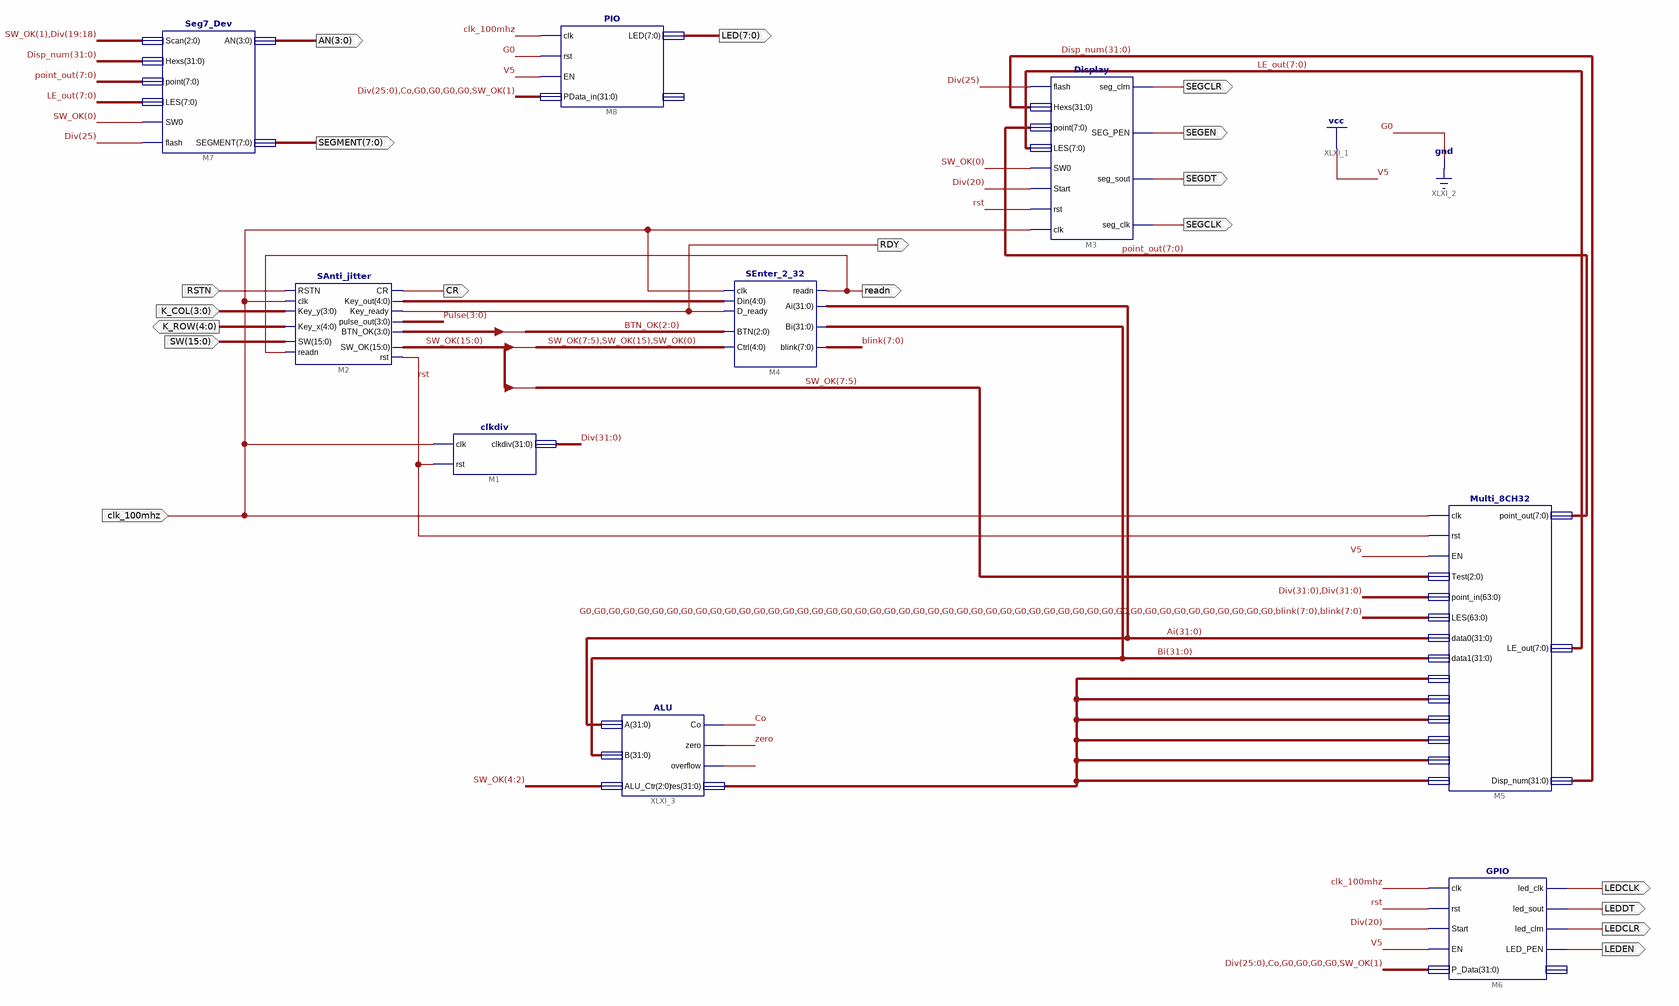
[diagram p0: schematic sheet 1]
// Xilinx ISE schematic Frame.sch (kintex7) as structural Verilog: 9 symbols, 19 ports
module Frame (
  input  RSTN,
  input  [3:0] K_COL,
  input  [15:0] SW,
  input  clk_100mhz,
  output [4:0] K_ROW,
  output readn,
  output RDY,
  output CR,
  output SEGCLR,
  output SEGEN,
  output SEGDT,
  output SEGCLK,
  output LEDCLK,
  output LEDDT,
  output LEDCLR,
  output LEDEN,
  output [7:0] LED,
  output [7:0] SEGMENT,
  output [3:0] AN
);

  wire Co, rst, XLXN_59, zero;
  wire [3:0] BTN_OK, Pulse;
  wire [4:0] XLXN_25;
  wire [7:0] blink, LE_out, point_out;
  wire [15:0] SW_OK;
  wire [31:0] Ai, Bi, Disp_num, Div, XLXN_62;

  SAnti_jitter M2 (
    .SW(SW), .readn(readn), .Key_y(K_COL), .Key_x(K_ROW), .RSTN(RSTN), .clk(clk_100mhz), .Key_out(XLXN_25),
    .Key_ready(RDY), .CR(CR), .rst(rst), .SW_OK(SW_OK), .pulse_out(Pulse), .BTN_OK(BTN_OK));
  Seg7_Dev M7 (
    .Scan({SW_OK[1], Div[19:18]}), .Hexs(Disp_num), .point(point_out), .LES(LE_out), .flash(Div[25]),
    .SW0(SW_OK[0]), .AN(AN), .SEGMENT(SEGMENT));
  PIO M8 (
    .clk(clk_100mhz), .rst(1'b0), .EN(1'b1), .PData_in({Div[25:0], Co, 4'b0000, SW_OK[1]}), .LED(LED));  // open: GPIOf0
  Display M3 (
    .flash(Div[25]), .Hexs(Disp_num), .point(point_out), .LES(LE_out), .SW0(SW_OK[0]), .Start(Div[20]),
    .rst(rst), .clk(clk_100mhz), .seg_clrn(SEGCLR), .SEG_PEN(SEGEN), .seg_sout(SEGDT), .seg_clk(SEGCLK));
  Multi_8CH32 M5 (
    .clk(clk_100mhz), .rst(rst), .EN(1'b1), .Test(SW_OK[7:5]), .point_in({Div, Div}),
    .LES({{48{1'b0}}, blink, blink}), .data0(Ai), .data1(Bi), .data2(XLXN_62), .data3(XLXN_62),
    .data4(XLXN_62), .data5(XLXN_62), .data6(XLXN_62), .data7(XLXN_62), .point_out(point_out),
    .LE_out(LE_out), .Disp_num(Disp_num));
  GPIO M6 (
    .clk(clk_100mhz), .rst(rst), .Start(Div[20]), .EN(1'b1), .P_Data({Div[25:0], Co, 4'b0000, SW_OK[1]}),
    .led_clk(LEDCLK), .led_sout(LEDDT), .led_clrn(LEDCLR), .LED_PEN(LEDEN));  // open: GPIOf0
  clkdiv M1 (.clk(clk_100mhz), .rst(rst), .clkdiv(Div));
  SEnter_2_32 M4 (
    .readn(readn), .Ai(Ai), .Bi(Bi), .blink(blink), .Din(XLXN_25), .D_ready(RDY), .clk(clk_100mhz),
    .Ctrl({SW_OK[7:5], SW_OK[15], SW_OK[0]}), .BTN(BTN_OK[2:0]));
  ALU XLXI_3 (.A(Ai), .B(Bi), .ALU_Ctr(SW_OK[4:2]), .Co(Co), .zero(zero), .overflow(XLXN_59), .res(XLXN_62));
endmodule
